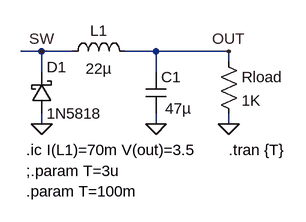
[diagram p0: schematic StepDownRevers.asc]
StepDownRevers.asc, the LTspice schematic file:
Version 4
SHEET 1 2900 1300
WIRE 2320 976 2288 976
WIRE 2368 976 2320 976
WIRE 2496 976 2448 976
WIRE 2608 976 2496 976
WIRE 2608 992 2608 976
WIRE 2320 1008 2320 976
WIRE 2496 1008 2496 976
WIRE 2320 1088 2320 1072
WIRE 2496 1088 2496 1072
WIRE 2608 1088 2608 1072
FLAG 2320 1088 0
FLAG 2496 1088 0
FLAG 2608 1088 0
FLAG 2608 976 OUT
FLAG 2320 976 SW
SYMBOL schottky 2304 1072 M180
WINDOW 0 24 72 Left 0
WINDOW 3 24 0 Left 0
SYMATTR InstName D1
SYMATTR Value 1N5818
SYMBOL ind 2352 992 R270
WINDOW 0 32 56 VTop 0
WINDOW 3 5 56 VBottom 0
SYMATTR InstName L1
SYMATTR Value 22µ
SYMATTR SpiceLine Rpar=10k
SYMBOL cap 2480 1008 R0
WINDOW 123 31 81 Left 0
WINDOW 3 30 56 Left 0
SYMATTR Value 47µ
SYMATTR InstName C1
SYMBOL res 2592 976 R0
SYMATTR InstName Rload
SYMATTR Value 1K
TEXT 2608 1128 Left 0 !.tran {T}
TEXT 2296 1128 Left 0 !.ic I(L1)=70m V(out)=3.5
TEXT 2296 1160 Left 0 !;.param T=3u
TEXT 2296 1192 Left 0 !.param T=100m

The netlist it stands for:
* StepDownRevers.asc
D1 0 SW 1N5818
L1 SW OUT 22µ Rpar=10k
C1 OUT 0 47µ
Rload OUT 0 1K
.model D D
.lib standard.dio
.tran {T}
.ic I(L1)=70m V(out)=3.5
;.param T=3u
.param T=100m
.backanno
.end